# EAGLE schematic MainBoard (EAGLE 9.7.0)
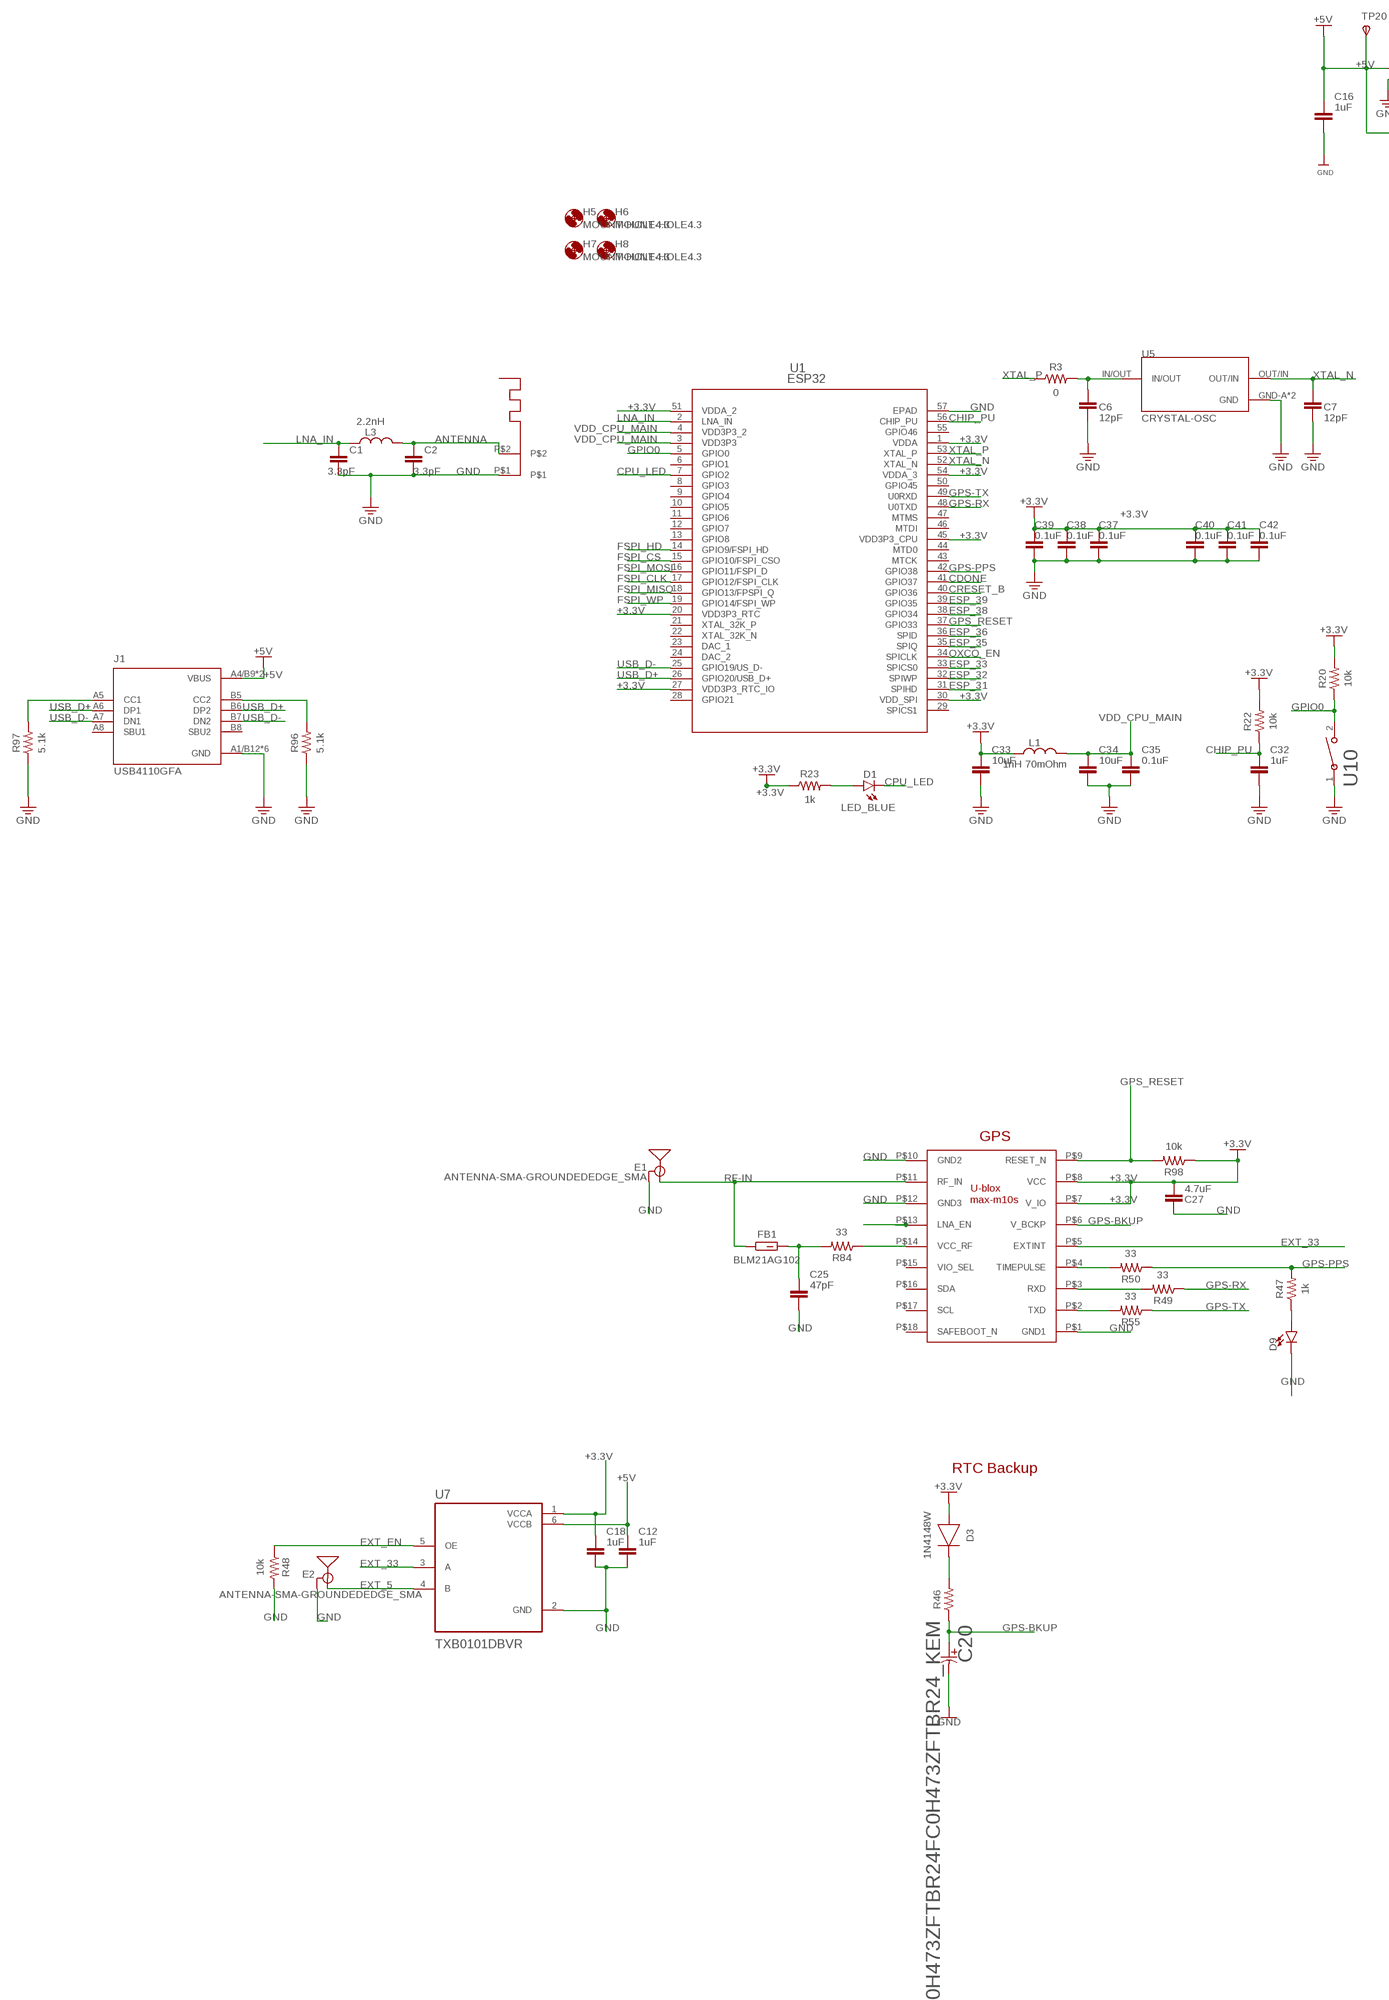
[diagram p0: schematic, sheet 1, part 1 of 2]
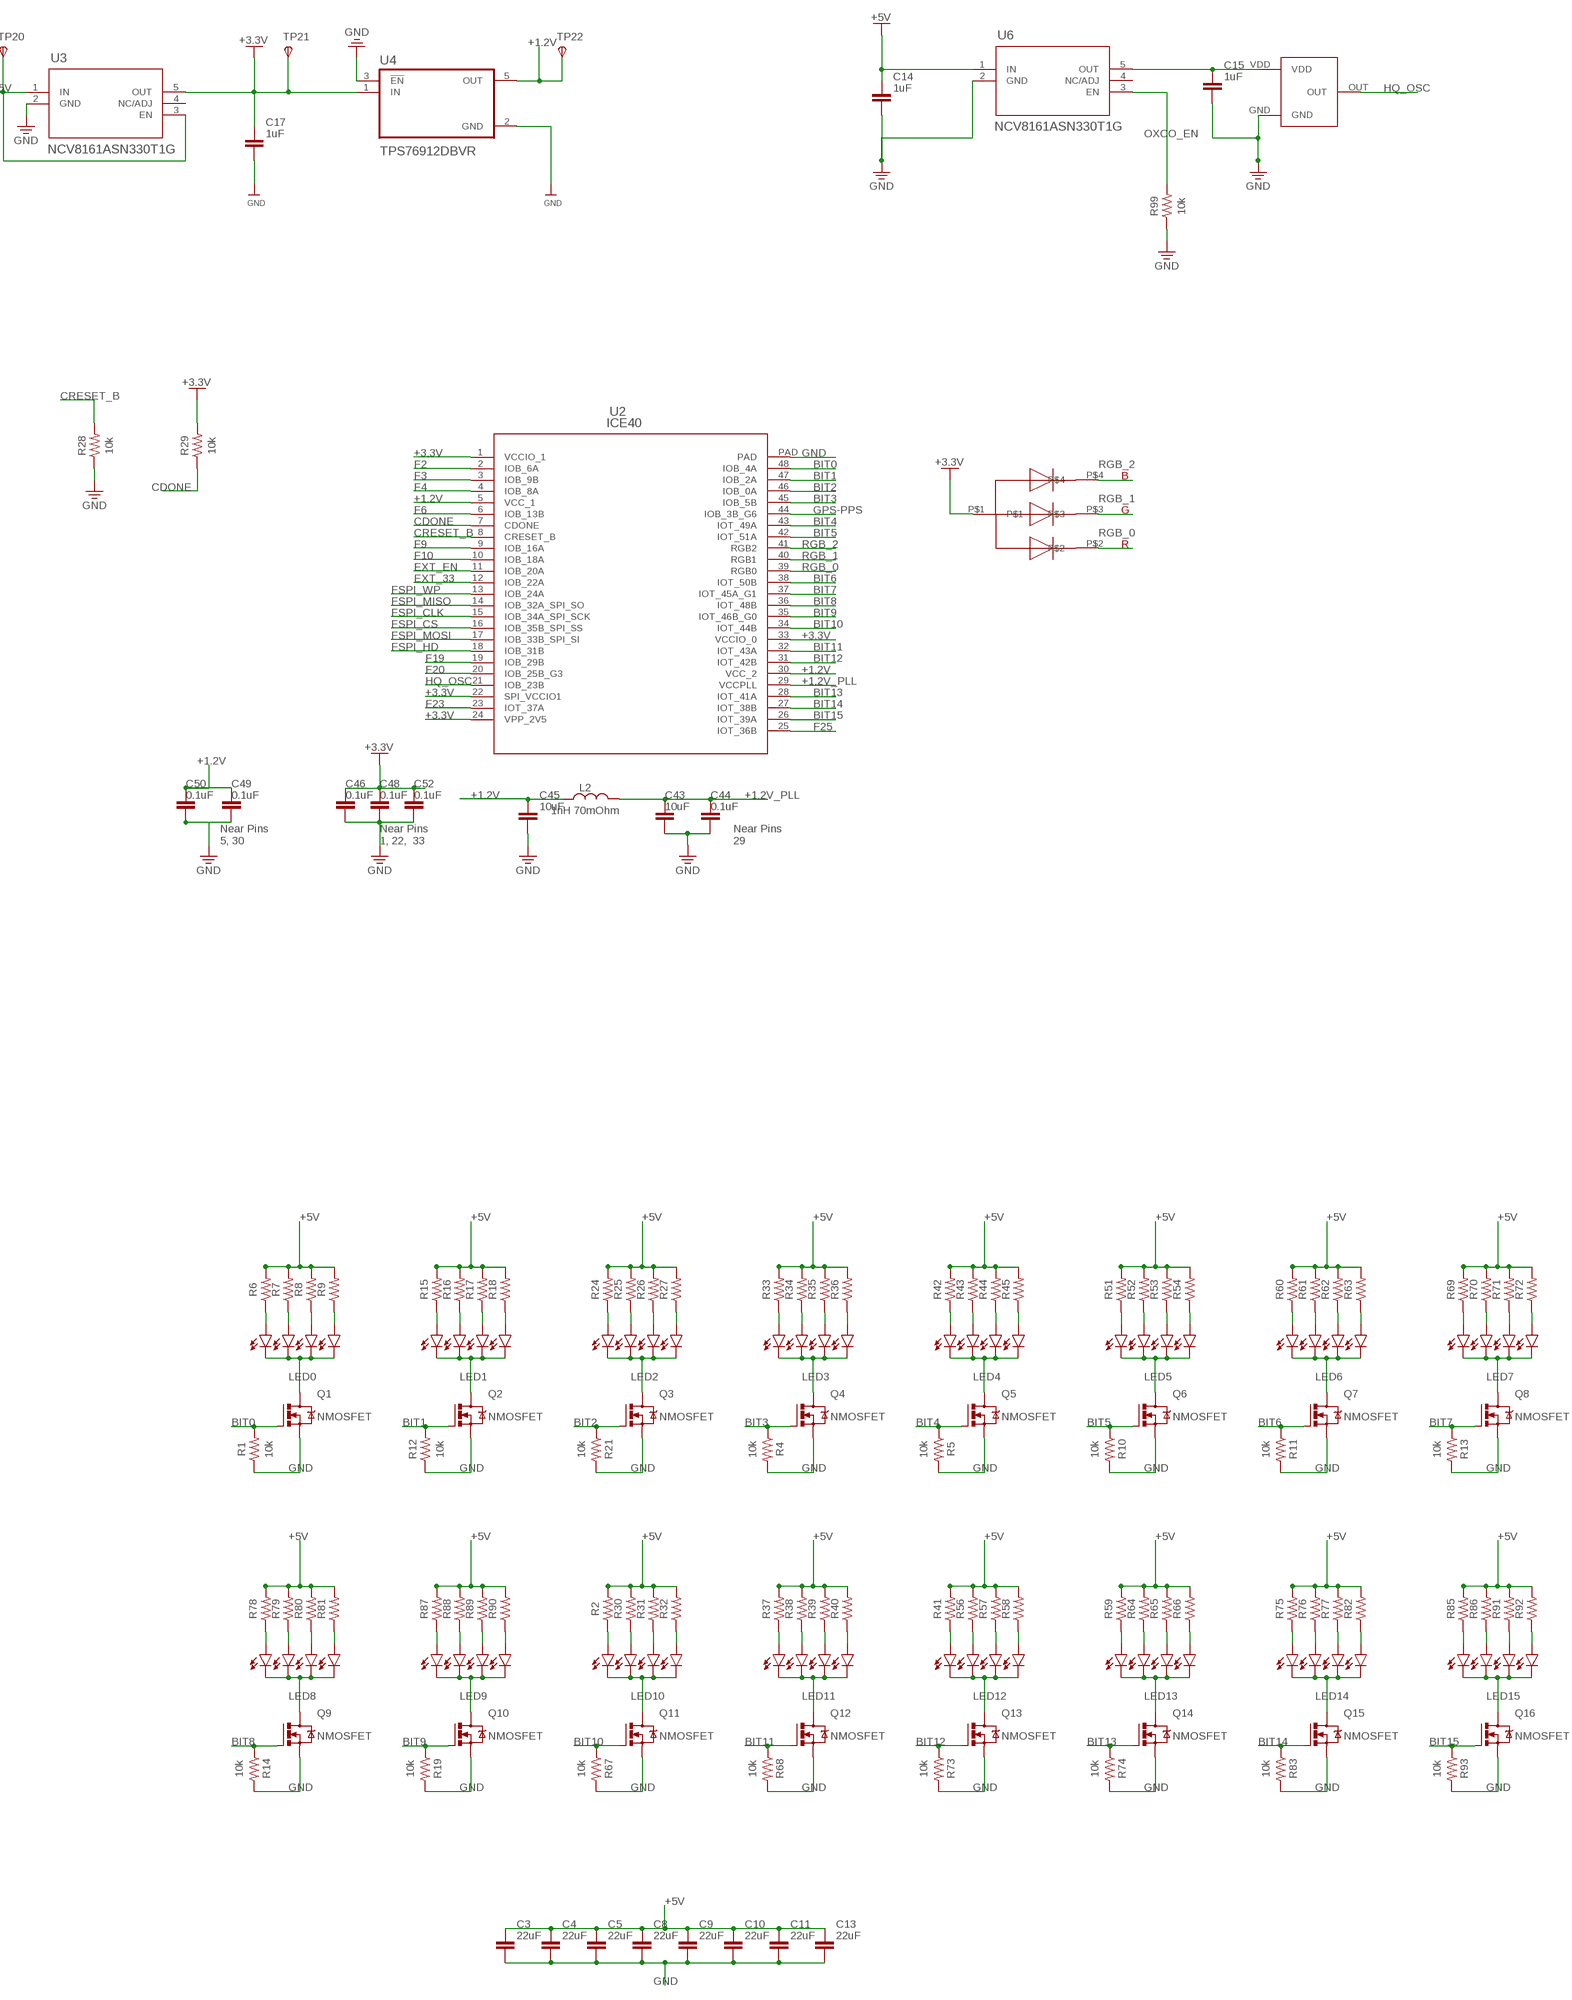
[diagram p1: schematic, sheet 1, part 2 of 2]

## Parts
C1  3.3pF  C_CHIP-0402(1005-METRIC)  [CAPC1005X60]
C2  3.3pF  C_CHIP-0402(1005-METRIC)  [CAPC1005X60]
C3  22uF  C_CHIP-1210(3225-METRIC)  [CAPC3225X135]
C4  22uF  C_CHIP-1210(3225-METRIC)  [CAPC3225X135]
C5  22uF  C_CHIP-1210(3225-METRIC)  [CAPC3225X135]
C6  12pF  C_CHIP-0402(1005-METRIC)  [CAPC1005X60]
C7  12pF  C_CHIP-0402(1005-METRIC)  [CAPC1005X60]
C8  22uF  C_CHIP-1210(3225-METRIC)  [CAPC3225X135]
C9  22uF  C_CHIP-1210(3225-METRIC)  [CAPC3225X135]
C10  22uF  C_CHIP-1210(3225-METRIC)  [CAPC3225X135]
C11  22uF  C_CHIP-1210(3225-METRIC)  [CAPC3225X135]
C12  1uF  C_CHIP-0402(1005-METRIC)  [CAPC1005X60]
C13  22uF  C_CHIP-1210(3225-METRIC)  [CAPC3225X135]
C14  1uF  C_CHIP-0805(2012-METRIC)  [CAPC2012X110]
C15  1uF  C_CHIP-0805(2012-METRIC)  [CAPC2012X110]
C16  1uF  C_CHIP-0805(2012-METRIC)  [CAPC2012X110]
C17  1uF  C_CHIP-0805(2012-METRIC)  [CAPC2012X110]
C18  1uF  C_CHIP-0402(1005-METRIC)  [CAPC1005X60]
C20  FC0H473ZFTBR24FC0H473ZFTBR24_KEM  [FC0H473ZFTBR24_KEM]
C25  47pF  C_CHIP-0402(1005-METRIC)  [CAPC1005X60]
C27  4.7uF  C_CHIP-0402(1005-METRIC)  [CAPC1005X60]
C32  1uF  C_CHIP-0402(1005-METRIC)  [CAPC1005X60]
C33  10uF  C_CHIP-0402(1005-METRIC)  [CAPC1005X60]
C34  10uF  C_CHIP-0402(1005-METRIC)  [CAPC1005X60]
C35  0.1uF  C_CHIP-0402(1005-METRIC)  [CAPC1005X60]
C37  0.1uF  C_CHIP-0402(1005-METRIC)  [CAPC1005X60]
C38  0.1uF  C_CHIP-0402(1005-METRIC)  [CAPC1005X60]
C39  0.1uF  C_CHIP-0402(1005-METRIC)  [CAPC1005X60]
C40  0.1uF  C_CHIP-0402(1005-METRIC)  [CAPC1005X60]
C41  0.1uF  C_CHIP-0402(1005-METRIC)  [CAPC1005X60]
C42  0.1uF  C_CHIP-0402(1005-METRIC)  [CAPC1005X60]
C43  10uF  C_CHIP-0402(1005-METRIC)  [CAPC1005X60]
C44  0.1uF  C_CHIP-0402(1005-METRIC)  [CAPC1005X60]
C45  10uF  C_CHIP-0402(1005-METRIC)  [CAPC1005X60]
C46  0.1uF  C_CHIP-0402(1005-METRIC)  [CAPC1005X60]
C48  0.1uF  C_CHIP-0402(1005-METRIC)  [CAPC1005X60]
C49  0.1uF  C_CHIP-0402(1005-METRIC)  [CAPC1005X60]
C50  0.1uF  C_CHIP-0402(1005-METRIC)  [CAPC1005X60]
C52  0.1uF  C_CHIP-0402(1005-METRIC)  [CAPC1005X60]
D1  LED_BLUE  CHIP-FLAT-B_0402  [LEDC1005X25N_FLAT-B]
D2  LED_BLUE  CHIP-ROUND-B_1206  [LEDC3216X180N_RND-B]
D3  1N4148W  DIODE_1N4148W-7-F_SOD123G  [SOD3715X135]
D4  LED_BLUE  CHIP-ROUND-B_1206  [LEDC3216X180N_RND-B]
D5  LED_BLUE  CHIP-ROUND-B_1206  [LEDC3216X180N_RND-B]
D6  LED_BLUE  CHIP-ROUND-B_1206  [LEDC3216X180N_RND-B]
D7  LED_BLUE  CHIP-ROUND-B_1206  [LEDC3216X180N_RND-B]
D8  LED_BLUE  CHIP-ROUND-B_1206  [LEDC3216X180N_RND-B]
D9  LED0603  [LED-0603]
D10  LED_BLUE  CHIP-ROUND-B_1206  [LEDC3216X180N_RND-B]
D11  LED_BLUE  CHIP-ROUND-B_1206  [LEDC3216X180N_RND-B]
D12  LED_BLUE  CHIP-ROUND-B_1206  [LEDC3216X180N_RND-B]
D13  LED_BLUE  CHIP-ROUND-B_1206  [LEDC3216X180N_RND-B]
D14  LED_BLUE  CHIP-ROUND-B_1206  [LEDC3216X180N_RND-B]
D15  LED_BLUE  CHIP-ROUND-B_1206  [LEDC3216X180N_RND-B]
D16  LED_BLUE  CHIP-ROUND-B_1206  [LEDC3216X180N_RND-B]
D17  LED_BLUE  CHIP-ROUND-B_1206  [LEDC3216X180N_RND-B]
D18  LED_BLUE  CHIP-ROUND-B_1206  [LEDC3216X180N_RND-B]
D19  LED_BLUE  CHIP-ROUND-B_1206  [LEDC3216X180N_RND-B]
D20  LED_BLUE  CHIP-ROUND-B_1206  [LEDC3216X180N_RND-B]
D21  LED_BLUE  CHIP-ROUND-B_1206  [LEDC3216X180N_RND-B]
D22  LED_BLUE  CHIP-ROUND-B_1206  [LEDC3216X180N_RND-B]
D23  LED_BLUE  CHIP-ROUND-B_1206  [LEDC3216X180N_RND-B]
D24  LED_BLUE  CHIP-ROUND-B_1206  [LEDC3216X180N_RND-B]
D25  LED_BLUE  CHIP-ROUND-B_1206  [LEDC3216X180N_RND-B]
D26  LED_BLUE  CHIP-ROUND-B_1206  [LEDC3216X180N_RND-B]
D27  LED_BLUE  CHIP-ROUND-B_1206  [LEDC3216X180N_RND-B]
D28  LED_BLUE  CHIP-ROUND-B_1206  [LEDC3216X180N_RND-B]
D29  LED_BLUE  CHIP-ROUND-B_1206  [LEDC3216X180N_RND-B]
D30  LED_BLUE  CHIP-ROUND-B_1206  [LEDC3216X180N_RND-B]
D31  LED_BLUE  CHIP-ROUND-B_1206  [LEDC3216X180N_RND-B]
D32  LED_BLUE  CHIP-ROUND-B_1206  [LEDC3216X180N_RND-B]
D33  LED_BLUE  CHIP-ROUND-B_1206  [LEDC3216X180N_RND-B]
D34  LED_BLUE  CHIP-ROUND-B_1206  [LEDC3216X180N_RND-B]
D35  LED_BLUE  CHIP-ROUND-B_1206  [LEDC3216X180N_RND-B]
D36  LED_BLUE  CHIP-ROUND-B_1206  [LEDC3216X180N_RND-B]
D37  LED_BLUE  CHIP-ROUND-B_1206  [LEDC3216X180N_RND-B]
D38  LED_BLUE  CHIP-ROUND-B_1206  [LEDC3216X180N_RND-B]
D39  LED_BLUE  CHIP-ROUND-B_1206  [LEDC3216X180N_RND-B]
D40  LED_BLUE  CHIP-ROUND-B_1206  [LEDC3216X180N_RND-B]
D41  LED_BLUE  CHIP-ROUND-B_1206  [LEDC3216X180N_RND-B]
D42  LED_BLUE  CHIP-ROUND-B_1206  [LEDC3216X180N_RND-B]
D43  LED_BLUE  CHIP-ROUND-B_1206  [LEDC3216X180N_RND-B]
D44  LED_BLUE  CHIP-ROUND-B_1206  [LEDC3216X180N_RND-B]
D45  LED_BLUE  CHIP-ROUND-B_1206  [LEDC3216X180N_RND-B]
D46  LED_BLUE  CHIP-ROUND-B_1206  [LEDC3216X180N_RND-B]
D47  LED_BLUE  CHIP-ROUND-B_1206  [LEDC3216X180N_RND-B]
D48  LED_BLUE  CHIP-ROUND-B_1206  [LEDC3216X180N_RND-B]
D49  LED_BLUE  CHIP-ROUND-B_1206  [LEDC3216X180N_RND-B]
D50  LED_BLUE  CHIP-ROUND-B_1206  [LEDC3216X180N_RND-B]
D51  LED_BLUE  CHIP-ROUND-B_1206  [LEDC3216X180N_RND-B]
D52  LED_BLUE  CHIP-ROUND-B_1206  [LEDC3216X180N_RND-B]
D53  LED_BLUE  CHIP-ROUND-B_1206  [LEDC3216X180N_RND-B]
D54  LED_BLUE  CHIP-ROUND-B_1206  [LEDC3216X180N_RND-B]
D55  LED_BLUE  CHIP-ROUND-B_1206  [LEDC3216X180N_RND-B]
D60  LED_BLUE  CHIP-ROUND-B_1206  [LEDC3216X180N_RND-B]
D61  LED_BLUE  CHIP-ROUND-B_1206  [LEDC3216X180N_RND-B]
D62  LED_BLUE  CHIP-ROUND-B_1206  [LEDC3216X180N_RND-B]
D63  LED_BLUE  CHIP-ROUND-B_1206  [LEDC3216X180N_RND-B]
D68  LED_BLUE  CHIP-ROUND-B_1206  [LEDC3216X180N_RND-B]
D69  LED_BLUE  CHIP-ROUND-B_1206  [LEDC3216X180N_RND-B]
D70  LED_BLUE  CHIP-ROUND-B_1206  [LEDC3216X180N_RND-B]
D71  LED_BLUE  CHIP-ROUND-B_1206  [LEDC3216X180N_RND-B]
D76  LED_BLUE  CHIP-ROUND-B_1206  [LEDC3216X180N_RND-B]
D77  LED_BLUE  CHIP-ROUND-B_1206  [LEDC3216X180N_RND-B]
D78  LED_BLUE  CHIP-ROUND-B_1206  [LEDC3216X180N_RND-B]
D79  LED_BLUE  CHIP-ROUND-B_1206  [LEDC3216X180N_RND-B]
E1  ANTENNA-SMA-GROUNDEDEDGE_SMA  [SMA-EDGE]
E2  ANTENNA-SMA-GROUNDEDEDGE_SMA  [SMA-EDGE]
FB1  BLM21AG102  FB_BLM21AG102SN1D_0805(2012)  [BEADC2012X105N]
H5  MOUNT-HOLE4.3  [4,3]
H6  MOUNT-HOLE4.3  [4,3]
H7  MOUNT-HOLE4.3  [4,3]
H8  MOUNT-HOLE4.3  [4,3]
J1  USB4110GFA  [GCT_USB4110GFA]
L1  1nH 70mOhm  L_CHIP-0402(1006-METRIC)  [INDC1006X60N]
L2  1nH 70mOhm  L_CHIP-0402(1006-METRIC)  [INDC1006X60N]
L3  2.2nH  L_CHIP-0402(1006-METRIC)  [INDC1006X60N]
Q1  NMOSFET  NMOSFETSOT23-GSD  [SOT23]
Q2  NMOSFET  NMOSFETSOT23-GSD  [SOT23]
Q3  NMOSFET  NMOSFETSOT23-GSD  [SOT23]
Q4  NMOSFET  NMOSFETSOT23-GSD  [SOT23]
Q5  NMOSFET  NMOSFETSOT23-GSD  [SOT23]
Q6  NMOSFET  NMOSFETSOT23-GSD  [SOT23]
Q7  NMOSFET  NMOSFETSOT23-GSD  [SOT23]
Q8  NMOSFET  NMOSFETSOT23-GSD  [SOT23]
Q9  NMOSFET  NMOSFETSOT23-GSD  [SOT23]
Q10  NMOSFET  NMOSFETSOT23-GSD  [SOT23]
Q11  NMOSFET  NMOSFETSOT23-GSD  [SOT23]
Q12  NMOSFET  NMOSFETSOT23-GSD  [SOT23]
Q13  NMOSFET  NMOSFETSOT23-GSD  [SOT23]
Q14  NMOSFET  NMOSFETSOT23-GSD  [SOT23]
Q15  NMOSFET  NMOSFETSOT23-GSD  [SOT23]
Q16  NMOSFET  NMOSFETSOT23-GSD  [SOT23]
R1  10k  R-US_CHIP-0805(2012-METRIC)  [RESC2012X65]
R2  R-US_CHIP-0805(2012-METRIC)  [RESC2012X65]
R3  0  R-US_CHIP-0402(1005-METRIC)  [RESC1005X40]
R4  10k  R-US_CHIP-0805(2012-METRIC)  [RESC2012X65]
R5  10k  R-US_CHIP-0805(2012-METRIC)  [RESC2012X65]
R6  R-US_CHIP-0805(2012-METRIC)  [RESC2012X65]
R7  R-US_CHIP-0805(2012-METRIC)  [RESC2012X65]
R8  R-US_CHIP-0805(2012-METRIC)  [RESC2012X65]
R9  R-US_CHIP-0805(2012-METRIC)  [RESC2012X65]
R10  10k  R-US_CHIP-0805(2012-METRIC)  [RESC2012X65]
R11  10k  R-US_CHIP-0805(2012-METRIC)  [RESC2012X65]
R12  10k  R-US_CHIP-0805(2012-METRIC)  [RESC2012X65]
R13  10k  R-US_CHIP-0805(2012-METRIC)  [RESC2012X65]
R14  10k  R-US_CHIP-0805(2012-METRIC)  [RESC2012X65]
R15  R-US_CHIP-0805(2012-METRIC)  [RESC2012X65]
R16  R-US_CHIP-0805(2012-METRIC)  [RESC2012X65]
R17  R-US_CHIP-0805(2012-METRIC)  [RESC2012X65]
R18  R-US_CHIP-0805(2012-METRIC)  [RESC2012X65]
R19  10k  R-US_CHIP-0805(2012-METRIC)  [RESC2012X65]
R20  10k  R-US_CHIP-0402(1005-METRIC)  [RESC1005X40]
R21  10k  R-US_CHIP-0805(2012-METRIC)  [RESC2012X65]
R22  10k  R-US_CHIP-0402(1005-METRIC)  [RESC1005X40]
R23  1k  R-US_CHIP-0402(1005-METRIC)  [RESC1005X40]
R24  R-US_CHIP-0805(2012-METRIC)  [RESC2012X65]
R25  R-US_CHIP-0805(2012-METRIC)  [RESC2012X65]
R26  R-US_CHIP-0805(2012-METRIC)  [RESC2012X65]
R27  R-US_CHIP-0805(2012-METRIC)  [RESC2012X65]
R28  10k  R-US_CHIP-0402(1005-METRIC)  [RESC1005X40]
R29  10k  R-US_CHIP-0402(1005-METRIC)  [RESC1005X40]
R30  R-US_CHIP-0805(2012-METRIC)  [RESC2012X65]
R31  R-US_CHIP-0805(2012-METRIC)  [RESC2012X65]
R32  R-US_CHIP-0805(2012-METRIC)  [RESC2012X65]
R33  R-US_CHIP-0805(2012-METRIC)  [RESC2012X65]
R34  R-US_CHIP-0805(2012-METRIC)  [RESC2012X65]
R35  R-US_CHIP-0805(2012-METRIC)  [RESC2012X65]
R36  R-US_CHIP-0805(2012-METRIC)  [RESC2012X65]
R37  R-US_CHIP-0805(2012-METRIC)  [RESC2012X65]
R38  R-US_CHIP-0805(2012-METRIC)  [RESC2012X65]
R39  R-US_CHIP-0805(2012-METRIC)  [RESC2012X65]
R40  R-US_CHIP-0805(2012-METRIC)  [RESC2012X65]
R41  R-US_CHIP-0805(2012-METRIC)  [RESC2012X65]
R42  R-US_CHIP-0805(2012-METRIC)  [RESC2012X65]
R43  R-US_CHIP-0805(2012-METRIC)  [RESC2012X65]
R44  R-US_CHIP-0805(2012-METRIC)  [RESC2012X65]
R45  R-US_CHIP-0805(2012-METRIC)  [RESC2012X65]
R46  R-US_CHIP-0805(2012-METRIC)  [RESC2012X65]
R47  1k  R-US_CHIP-0402(1005-METRIC)  [RESC1005X40]
R48  10k  R-US_CHIP-0402(1005-METRIC)  [RESC1005X40]
R49  33  R-US_CHIP-0402(1005-METRIC)  [RESC1005X40]
R50  33  R-US_CHIP-0402(1005-METRIC)  [RESC1005X40]
R51  R-US_CHIP-0805(2012-METRIC)  [RESC2012X65]
R52  R-US_CHIP-0805(2012-METRIC)  [RESC2012X65]
R53  R-US_CHIP-0805(2012-METRIC)  [RESC2012X65]
R54  R-US_CHIP-0805(2012-METRIC)  [RESC2012X65]
R55  33  R-US_CHIP-0402(1005-METRIC)  [RESC1005X40]
R56  R-US_CHIP-0805(2012-METRIC)  [RESC2012X65]
R57  R-US_CHIP-0805(2012-METRIC)  [RESC2012X65]
R58  R-US_CHIP-0805(2012-METRIC)  [RESC2012X65]
R59  R-US_CHIP-0805(2012-METRIC)  [RESC2012X65]
R60  R-US_CHIP-0805(2012-METRIC)  [RESC2012X65]
R61  R-US_CHIP-0805(2012-METRIC)  [RESC2012X65]
R62  R-US_CHIP-0805(2012-METRIC)  [RESC2012X65]
R63  R-US_CHIP-0805(2012-METRIC)  [RESC2012X65]
R64  R-US_CHIP-0805(2012-METRIC)  [RESC2012X65]
R65  R-US_CHIP-0805(2012-METRIC)  [RESC2012X65]
R66  R-US_CHIP-0805(2012-METRIC)  [RESC2012X65]
R67  10k  R-US_CHIP-0805(2012-METRIC)  [RESC2012X65]
R68  10k  R-US_CHIP-0805(2012-METRIC)  [RESC2012X65]
R69  R-US_CHIP-0805(2012-METRIC)  [RESC2012X65]
R70  R-US_CHIP-0805(2012-METRIC)  [RESC2012X65]
R71  R-US_CHIP-0805(2012-METRIC)  [RESC2012X65]
R72  R-US_CHIP-0805(2012-METRIC)  [RESC2012X65]
R73  10k  R-US_CHIP-0805(2012-METRIC)  [RESC2012X65]
R74  10k  R-US_CHIP-0805(2012-METRIC)  [RESC2012X65]
R75  R-US_CHIP-0805(2012-METRIC)  [RESC2012X65]
R76  R-US_CHIP-0805(2012-METRIC)  [RESC2012X65]
R77  R-US_CHIP-0805(2012-METRIC)  [RESC2012X65]
R78  R-US_CHIP-0805(2012-METRIC)  [RESC2012X65]
R79  R-US_CHIP-0805(2012-METRIC)  [RESC2012X65]
R80  R-US_CHIP-0805(2012-METRIC)  [RESC2012X65]
R81  R-US_CHIP-0805(2012-METRIC)  [RESC2012X65]
R82  R-US_CHIP-0805(2012-METRIC)  [RESC2012X65]
R83  10k  R-US_CHIP-0805(2012-METRIC)  [RESC2012X65]
R84  33  R-US_CHIP-0402(1005-METRIC)  [RESC1005X40]
R85  R-US_CHIP-0805(2012-METRIC)  [RESC2012X65]
R86  R-US_CHIP-0805(2012-METRIC)  [RESC2012X65]
R87  R-US_CHIP-0805(2012-METRIC)  [RESC2012X65]
R88  R-US_CHIP-0805(2012-METRIC)  [RESC2012X65]
R89  R-US_CHIP-0805(2012-METRIC)  [RESC2012X65]
R90  R-US_CHIP-0805(2012-METRIC)  [RESC2012X65]
R91  R-US_CHIP-0805(2012-METRIC)  [RESC2012X65]
R92  R-US_CHIP-0805(2012-METRIC)  [RESC2012X65]
R93  10k  R-US_CHIP-0805(2012-METRIC)  [RESC2012X65]
R96  5.1k  R-US_CHIP-0402(1005-METRIC)  [RESC1005X40]
R97  5.1k  R-US_CHIP-0402(1005-METRIC)  [RESC1005X40]
R98  10k  R-US_CHIP-0402(1005-METRIC)  [RESC1005X40]
R99  10k  R-US_CHIP-0402(1005-METRIC)  [RESC1005X40]
TP20  TPSB1,27  [B1,27]
TP21  TPSB1,27  [B1,27]
TP22  TPSB1,27  [B1,27]
U1  ESP32  [QFN56_ESP32-S2FH4_EXP-M]
U2  ICE40  [ICE40-QFN]
U3  NCV8161ASN330T1G  [TSOP5_3X1P5_ONS-M]
U4  TPS76912DBVR  [TPS76912DBVR]
U5  CRYSTAL-OSC  [XTAL_ECS-400-10-36-CKY-TR]
U6  NCV8161ASN330T1G  [TSOP5_3X1P5_ONS-M]
U7  TXB0101DBVR  [SOT95P280X145-6N]
U9  RGBLED  [RGBLED]
U10  TS-1185-C-A-A-A  [SW_CS1213AGF260_CRS]
U11  MAX-M10S-00B  [MAX-M10S-00B]
U$1  PCB-ANTENNA  [PCB-ANTENNA]
U$2  ACO97  [ACO97]

## Nets
+1.2V: C45.1 C49.1 C50.1 L2.1 TP22.TP(PP) U2.5(VCC_1) U2.30(VCC_2) U4.5(OUT)
+1.2V_PLL: C43.1 C44.1 L2.2 U2.29(VCCPLL)
+3.3V: C17.1 C18.1 C27.1 C33.1 C37.1 C38.1 C39.1 C40.1 C41.1 C42.1 C46.1 C48.1 C52.1 D3.2(A) L1.1 R20.2 R22.2 R23.1 R29.2 R98.1 TP21.TP(PP) U1.1(VDDA) U1.20(VDD3P3_RTC) U1.27(VDD3P3_RTC_IO) U1.30(VDD_SPI) U1.45(VDD3P3_CPU) U1.51(VDDA_2) U1.54(VDDA_3) U2.1(VCCIO_1) U2.22(SPI_VCCIO1) U2.24(VPP_2V5) U2.33(VCCIO_0) U3.5(OUT) U4.1(IN) U7.1(VCCA) U9.P$1 U11.P$7(V_IO) U11.P$8(VCC)
+5V: C3.1 C4.1 C5.1 C8.1 C9.1 C10.1 C11.1 C12.1 C13.1 C14.1 C16.1 J1.A4/B9(VBUS) J1.B4/A9(VBUS) R2.2 R6.2 R7.2 R8.2 R9.2 R15.2 R16.2 R17.2 R18.2 R24.2 R25.2 R26.2 R27.2 R30.2 R31.2 R32.2 R33.2 R34.2 R35.2 R36.2 R37.2 R38.2 R39.2 R40.2 R41.2 R42.2 R43.2 R44.2 R45.2 R51.2 R52.2 R53.2 R54.2 R56.2 R57.2 R58.2 R59.2 R60.2 R61.2 R62.2 R63.2 R64.2 R65.2 R66.2 R69.2 R70.2 R71.2 R72.2 R75.2 R76.2 R77.2 R78.2 R79.2 R80.2 R81.2 R82.2 R85.2 R86.2 R87.2 R88.2 R89.2 R90.2 R91.2 R92.2 TP20.TP(PP) U3.1(IN) U3.3(EN) U6.1(IN) U7.6(VCCB)
ANTENNA: C2.1 L3.2 U$1.P$2
BIT0: Q1.1(G) R1.2 U2.48(IOB_4A)
BIT1: Q2.1(G) R12.2 U2.47(IOB_2A)
BIT2: Q3.1(G) R21.1 U2.46(IOB_0A)
BIT3: Q4.1(G) R4.1 U2.45(IOB_5B)
BIT4: Q5.1(G) R5.1 U2.43(IOT_49A)
BIT5: Q6.1(G) R10.1 U2.42(IOT_51A)
BIT6: Q7.1(G) R11.1 U2.38(IOT_50B)
BIT7: Q8.1(G) R13.1 U2.37(IOT_45A_G1)
BIT8: Q9.1(G) R14.1 U2.36(IOT_48B)
BIT9: Q10.1(G) R19.1 U2.35(IOT_46B_G0)
BIT10: Q11.1(G) R67.1 U2.34(IOT_44B)
BIT11: Q12.1(G) R68.1 U2.32(IOT_43A)
BIT12: Q13.1(G) R73.1 U2.31(IOT_42B)
BIT13: Q14.1(G) R74.1 U2.28(IOT_41A)
BIT14: Q15.1(G) R83.1 U2.27(IOT_38B)
BIT15: Q16.1(G) R93.1 U2.26(IOT_39A)
CDONE: R29.1 U1.41(GPIO37) U2.7(CDONE)
CHIP_PU: C32.1 R22.1 U1.56(CHIP_PU)
CPU_LED: D1.C U1.7(GPIO2)
CRESET_B: R28.2 U1.40(GPIO36) U2.8(CRESET_B)
ESP_31: U1.31(SPIHD)
ESP_32: U1.32(SPIWP)
ESP_33: U1.33(SPICS0)
ESP_35: U1.35(SPIQ)
ESP_36: U1.36(SPID)
ESP_38: U1.38(GPIO34)
ESP_39: U1.39(GPIO35)
EXT_5: E2.SIG(SIGNAL) U7.4(B)
EXT_33: U2.12(IOB_22A) U7.3(A) U11.P$5(EXTINT)
EXT_EN: R48.1 U2.11(IOB_20A) U7.5(OE)
F2: U2.2(IOB_6A)
F3: U2.3(IOB_9B)
F4: U2.4(IOB_8A)
F6: U2.6(IOB_13B)
F9: U2.9(IOB_16A)
F10: U2.10(IOB_18A)
F19: U2.19(IOB_29B)
F20: U2.20(IOB_25B_G3)
F23: U2.23(IOT_37A)
F25: U2.25(IOT_36B)
FSPI_CLK: U1.17(GPIO12/FSPI_CLK) U2.15(IOB_34A_SPI_SCK)
FSPI_CS: U1.15(GPIO10/FSPI_CSO) U2.16(IOB_35B_SPI_SS)
FSPI_HD: U1.14(GPIO9/FSPI_HD) U2.18(IOB_31B)
FSPI_MISO: U1.18(GPIO13/FPSPI_Q) U2.14(IOB_32A_SPI_SO)
FSPI_MOSI: U1.16(GPIO11/FSPI_D) U2.17(IOB_33B_SPI_SI)
FSPI_WP: U1.19(GPIO14/FSPI_WP) U2.13(IOB_24A)
GND: C1.2 C2.2 C3.2 C4.2 C5.2 C6.2 C7.2 C8.2 C9.2 C10.2 C11.2 C12.2 C13.2 C14.2 C15.2 C16.2 C17.2 C18.2 C20.2 C25.2 C27.2 C32.2 C33.2 C34.2 C35.2 C37.2 C38.2 C39.2 C40.2 C41.2 C42.2 C43.2 C44.2 C45.2 C46.2 C48.2 C49.2 C50.2 C52.2 D9.C E1.GND@0(GND) E1.GND@1(GND) E1.GND@2(GND) E1.GND@3(GND) E2.GND@0(GND) E2.GND@1(GND) E2.GND@2(GND) E2.GND@3(GND) J1.A1/B12(GND) J1.B1/A12(GND) J1.S1(GND) J1.S2(GND) J1.S3(GND) J1.S4(GND) Q1.2(S) Q2.2(S) Q3.2(S) Q4.2(S) Q5.2(S) Q6.2(S) Q7.2(S) Q8.2(S) Q9.2(S) Q10.2(S) Q11.2(S) Q12.2(S) Q13.2(S) Q14.2(S) Q15.2(S) Q16.2(S) R1.1 R4.2 R5.2 R10.2 R11.2 R12.1 R13.2 R14.2 R19.2 R21.2 R28.1 R48.2 R67.2 R68.2 R73.2 R74.2 R83.2 R93.2 R96.1 R97.1 R99.1 U1.57(EPAD) U2.PAD U3.2(GND) U4.2(GND) U4.3(!EN) U5.GND-A(GND) U5.GND-B(GND) U6.2(GND) U7.2(GND) U10.1 U11.P$1(GND1) U11.P$10(GND2) U11.P$12(GND3) U$1.P$1 U$2.GND
GPIO0: R20.1 U1.5(GPIO0) U10.2
GPS-BKUP: C20.1 R46.1 U11.P$6(V_BCKP)
GPS-PPS: R47.2 R50.1 U1.42(GPIO38) U2.44(IOB_3B_G6)
GPS-RX: R49.1 U1.48(U0TXD)
GPS-TX: R55.1 U1.49(U0RXD)
GPS_RESET: R98.2 U1.37(GPIO33) U11.P$9(RESET_N)
HQ_OSC: U2.21(IOB_23B) U$2.OUT
LED0: D4.C D5.C D6.C D7.C Q1.3(D)
LED1: D12.C D13.C D14.C D15.C Q2.3(D)
LED2: D20.C D21.C D22.C D23.C Q3.3(D)
LED3: D28.C D29.C D30.C D31.C Q4.3(D)
LED4: D36.C D37.C D38.C D39.C Q5.3(D)
LED5: D44.C D45.C D46.C D47.C Q6.3(D)
LED6: D52.C D53.C D54.C D55.C Q7.3(D)
LED7: D60.C D61.C D62.C D63.C Q8.3(D)
LED8: D68.C D69.C D70.C D71.C Q9.3(D)
LED9: D76.C D77.C D78.C D79.C Q10.3(D)
LED10: D2.C D8.C D10.C D11.C Q11.3(D)
LED11: D16.C D17.C D18.C D19.C Q12.3(D)
LED12: D24.C D25.C D26.C D27.C Q13.3(D)
LED13: D32.C D33.C D34.C D35.C Q14.3(D)
LED14: D40.C D41.C D42.C D43.C Q15.3(D)
LED15: D48.C D49.C D50.C D51.C Q16.3(D)
LNA_IN: C1.1 L3.1 U1.2(LNA_IN)
N$1: D2.A R2.1
N$2: C6.1 R3.2 U5.IN/OUT
N$3: D1.A R23.2
N$5: D8.A R30.1
N$6: D10.A R31.1
N$7: D11.A R32.1
N$8: D4.A R6.1
N$9: D5.A R7.1
N$10: D6.A R8.1
N$11: D7.A R9.1
N$12: D16.A R37.1
N$13: D17.A R38.1
N$16: D12.A R15.1
N$17: D13.A R16.1
N$18: D14.A R17.1
N$19: D15.A R18.1
N$20: D18.A R39.1
N$21: D19.A R40.1
N$22: D24.A R41.1
N$23: D25.A R56.1
N$24: D26.A R57.1
N$25: D20.A R24.1
N$26: D21.A R25.1
N$27: D22.A R26.1
N$28: D23.A R27.1
N$29: D27.A R58.1
N$30: D32.A R59.1
N$32: U11.P$13(LNA_EN)
N$33: R84.1 U11.P$14(VCC_RF)
N$34: D28.A R33.1
N$35: D29.A R34.1
N$36: D30.A R35.1
N$37: D31.A R36.1
N$38: C25.1 FB1.2 R84.2
N$39: D9.A R47.1
N$40: D3.1(C) R46.2
N$41: D33.A R64.1
N$43: D36.A R42.1
N$44: D37.A R43.1
N$45: D38.A R44.1
N$46: D39.A R45.1
N$47: R50.2 U11.P$4(TIMEPULSE)
N$48: R49.2 U11.P$3(RXD)
N$49: R55.2 U11.P$2(TXD)
N$50: D34.A R65.1
N$51: D35.A R66.1
N$52: D44.A R51.1
N$53: D45.A R52.1
N$54: D46.A R53.1
N$55: D47.A R54.1
N$56: D40.A R75.1
N$57: D41.A R76.1
N$58: D42.A R77.1
N$59: D43.A R82.1
N$60: J1.A5(CC1) R97.2
N$61: D52.A R60.1
N$62: D53.A R61.1
N$63: D54.A R62.1
N$64: D55.A R63.1
N$66: J1.B5(CC2) R96.2
N$67: C15.1 U6.5(OUT) U$2.VDD
N$69: D48.A R85.1
N$70: D60.A R69.1
N$71: D61.A R70.1
N$72: D62.A R71.1
N$73: D63.A R72.1
N$74: D49.A R86.1
N$75: D50.A R91.1
N$76: D51.A R92.1
N$79: D68.A R78.1
N$80: D69.A R79.1
N$81: D70.A R80.1
N$82: D71.A R81.1
N$88: D76.A R87.1
N$89: D77.A R88.1
N$90: D78.A R89.1
N$91: D79.A R90.1
OXCO_EN: R99.2 U1.34(SPICLK) U6.3(EN)
RF-IN: E1.SIG(SIGNAL) FB1.1 U11.P$11(RF_IN)
RGB_0: U2.39(RGB0) U9.P$2
RGB_1: U2.40(RGB1) U9.P$3
RGB_2: U2.41(RGB2) U9.P$4
USB_D+: J1.A6(DP1) J1.B6(DP2) U1.26(GPIO20/USB_D+)
USB_D-: J1.A7(DN1) J1.B7(DN2) U1.25(GPIO19/US_D-)
VDD_CPU_MAIN: C34.1 C35.1 L1.2 U1.3(VDD3P3) U1.4(VDD3P3_2)
XTAL_N: C7.1 U1.52(XTAL_N) U5.OUT/IN
XTAL_P: R3.1 U1.53(XTAL_P)
Unconnected: J1.A8(SBU1) J1.B8(SBU2) U1.6(GPIO1) U1.8(GPIO3) U1.9(GPIO4) U1.10(GPIO5) U1.11(GPIO6) U1.12(GPIO7) U1.13(GPIO8) U1.21(XTAL_32K_P) U1.22(XTAL_32K_N) U1.23(DAC_1) U1.24(DAC_2) U1.28(GPIO21) U1.29(SPICS1) U1.43(MTCK) U1.44(MTD0) U1.46(MTDI) U1.47(MTMS) U1.50(GPIO45) U1.55(GPIO46) U3.4(NC/ADJ) U6.4(NC/ADJ) U11.P$15(VIO_SEL) U11.P$16(SDA) U11.P$17(SCL) U11.P$18(SAFEBOOT_N)

## Notes on the sheet
- Near Pins
  5, 30
- Near Pins
  1, 22,  33
- Near Pins
  29
- GPS
- RTC Backup

## Library data of the parts
C1 C2 = Capacitor:C: Capacitor - Generic; CATEGORY: Capacitor; LCSC_PART: C76906
C3-C5 C8-C11 C13 = Capacitor:C: Capacitor - Generic; CATEGORY: Capacitor; LCSC_PART: C52306
C6 C7 = Capacitor:C: Capacitor - Generic; CATEGORY: Capacitor; LCSC_PART: C26406
C12 C18 C32 = Capacitor:C: Capacitor - Generic; CATEGORY: Capacitor; LCSC_PART: C29266
C14-C17 = Capacitor:C: Capacitor - Generic; CATEGORY: Capacitor; LCSC: C28323
C20 = TImingBoardPartLibrary:FC0H473ZFTBR24; COPYRIGHT: Copyright (C) 2025 Ultra Librarian. All rights reserved.; MANUFACTURER_NAME: Kemet; MANUFACTURER_PART_NUMBER: FC0H473ZFTBR24
C25 = Capacitor:C: Capacitor - Generic; CATEGORY: Capacitor; LCSC_PART: C1671
C27 = Capacitor:C: Capacitor - Generic; CATEGORY: Capacitor; LCSC_PART: C23733
C33 C34 C43 C45 = Capacitor:C: Capacitor - Generic; CATEGORY: Capacitor; LCSC_PART: C76991
C35 C37-C42 C44 C46 C48-C50 C52 = Capacitor:C: Capacitor - Generic; CATEGORY: Capacitor; LCSC_PART: C1525
D1 = LED:CHIP-FLAT-B; CATEGORY: LED; COLOR: BLUE; DESCRIPTION: CHIP LED FLAT; LCSC_PART: C22355736; SUB-CATEGORY: CHIP; TYPE: FLAT_TOP
D2 D5-D8 D10-D55 D60-D63 D68-D71 D76-D79 = LED:CHIP-ROUND-B; CATEGORY: LED; COLOR: BLUE; DESCRIPTION: CHIP LED ROUND; SUB-CATEGORY: CHIP; TYPE: ROUND_TOP
D3 = Diode:DIODE_: Diode Rectifier - Popular parts; CATEGORY: Diode; DESCRIPTION: DIODE GEN PURP 100V 300MA SOD123; LCSC_PART: C2128; MANUFACTURER: Diodes Incorporated; SUB-CATEGORY: Rectifier
D4 = LED:CHIP-ROUND-B; CATEGORY: LED; COLOR: BLUE; DESCRIPTION: CHIP LED ROUND; LCSC_PART: C375482; SUB-CATEGORY: CHIP; TYPE: ROUND_TOP
D9 = TMC-5072-Lib:LED: LED (Generic) Standard schematic elements and footprints for 5mm, 3mm, 1206, and 0603 sized LEDs. Generic LEDs with no color specified.; LCSC_PART: C2286
E1 E2 = ScopeLib:ANTENNA-SMA-GROUNDED: SMA Antenna Connector w/ Ground Edge-mount and SMD SMA connectors for RF Antennas. **4-LAYER BOARD WARNING!!** When designing a 4-layer board using any of the SMD variants, you will need to manually add a cutout polygon on any internal power layers to make sure that you don't end up with exposed copper around the edge of the routed hole for these connectors. Exposed power copper could then short to the connector body - and that would be bad. Why hasn't anyone added the cutout polygons directly to the connector footprint? Well, your internal layers (usually 2 and 15) may be covered with GND polygons and you might well want the copper to go all the way to the edge, especially under the connector SIGNAL pin. So adding cutouts to the footprint might make matters worse, not better...; PROD_ID: CONN-08289
FB1 = Filter:FB_: Ferrite Bead - Popular parts; CATEGORY: Filter; DESCRIPTION: FERRITE BEAD 1 KOHM 0805 1LN; LCSC_PART: C76817; MANUFACTURER: Murata Electronics; SUB-CATEGORY: Ferrite bead
H5-H8 = USB4105:MOUNT-HOLE: MOUNTING HOLE with drill center marker
J1 = CoilDriveLibrary:USB4110GFA: Check availability <https://pricing.snapeda.com/parts/USB4110GFA/GCT/view-part?ref=eda>; AVAILABILITY: In Stock; DESCRIPTION: USB-C (USB TYPE-C) USB 2.0 Receptacle Connector 24 (16+8 Dummy) Position Surface Mount, Right Angle; Through Hole; LCSC_PART: C34260841; MF: GCT; MP: USB4110GFA; PACKAGE: None; PRICE: None
L1 L2 = TImingBoardPartLibrary:L: Inductor Fixed - Generic; CATEGORY: Inductor; CURRENT_RATING: 3A; LCSC_PART: C18222; MPN: BLM18KG101TN1D; SUB-CATEGORY: Fixed
L3 = TImingBoardPartLibrary:L: Inductor Fixed - Generic; CATEGORY: Inductor; CURRENT_RATING: 3A; LCSC_PART: C86061; MPN: BLM18KG101TN1D; SUB-CATEGORY: Fixed
Q1-Q16 = Transistor:NMOSFET: N-Channel MOSFET - Generic; CATEGORY: Transistor; LCSC_PART: C478010; SUB-CATEGORY: MOSFET; TYPE: N-Channel
R1 R4 R5 R10-R14 R19-R22 R28 R29 R48 R67 R68 R73 R74 R83 R93 R98 R99 = Resistor:R-US: Resistor Fixed - ANSI; CATEGORY: Resistor; LCSC_PART: C60490; SUB-CATEGORY: Fixed
R2 R6-R9 R15-R18 R24-R27 R30-R46 R51-R54 R56-R66 R69-R72 R75-R82 R85-R92 = Resistor:R-US: Resistor Fixed - ANSI; CATEGORY: Resistor; SUB-CATEGORY: Fixed
R3 = Resistor:R-US: Resistor Fixed - ANSI; CATEGORY: Resistor; LCSC_PART: C17168; SUB-CATEGORY: Fixed
R23 R47 = Resistor:R-US: Resistor Fixed - ANSI; CATEGORY: Resistor; LCSC_PART: C11702; SUB-CATEGORY: Fixed
R49 R50 R55 R84 = Resistor:R-US: Resistor Fixed - ANSI; CATEGORY: Resistor; LCSC_PART: C25105; SUB-CATEGORY: Fixed
R96 R97 = Resistor:R-US: Resistor Fixed - ANSI; CATEGORY: Resistor; LCSC_PART: C25905; SUB-CATEGORY: Fixed
TP20 TP22 = TImingBoardPartLibrary:TPS: TEST PIN
TP21 = TImingBoardPartLibrary:TPS: TEST PIN; LCSC: DNP
U1 = CoilDriveLibrary:ESP32; LCSC: C2841141
U2 = CoilDriveLibrary:ICE40; LCSC: C2678152
U3 U6 = TImingBoardPartLibrary:NCV8161ASN330T1G; LCSC: C604034
U4 = TImingBoardPartLibrary:TPS76912DBVR; LCSC: C523754
U5 = CoilDriveLibrary:CRYSTAL-OSC; LCSC: C555614
U7 = CoilDriveLibrary:TXB0101DBVR; LCSC: C2652944; SPICEPREFIX: X
U9 = CoilDriveLibrary:RGBLED; LCSC: C158099; URL: https://www.lcsc.com/datasheet/lcsc_datasheet_2009100902_Foshan-NationStar-Optoelectronics-FC-B1010RGBT-HG_C158099.pdf
U10 = CoilDriveLibrary:TS-1185-C-A-A-A; LCSC: C561518
U11 = ScopeLib:MAX-M10S-00B
U$1 = TImingBoardPartLibrary:PCB-ANTENNA
U$2 = TImingBoardPartLibrary:ACO97